# EAGLE design ME433_proto_board (EAGLE 5.12)
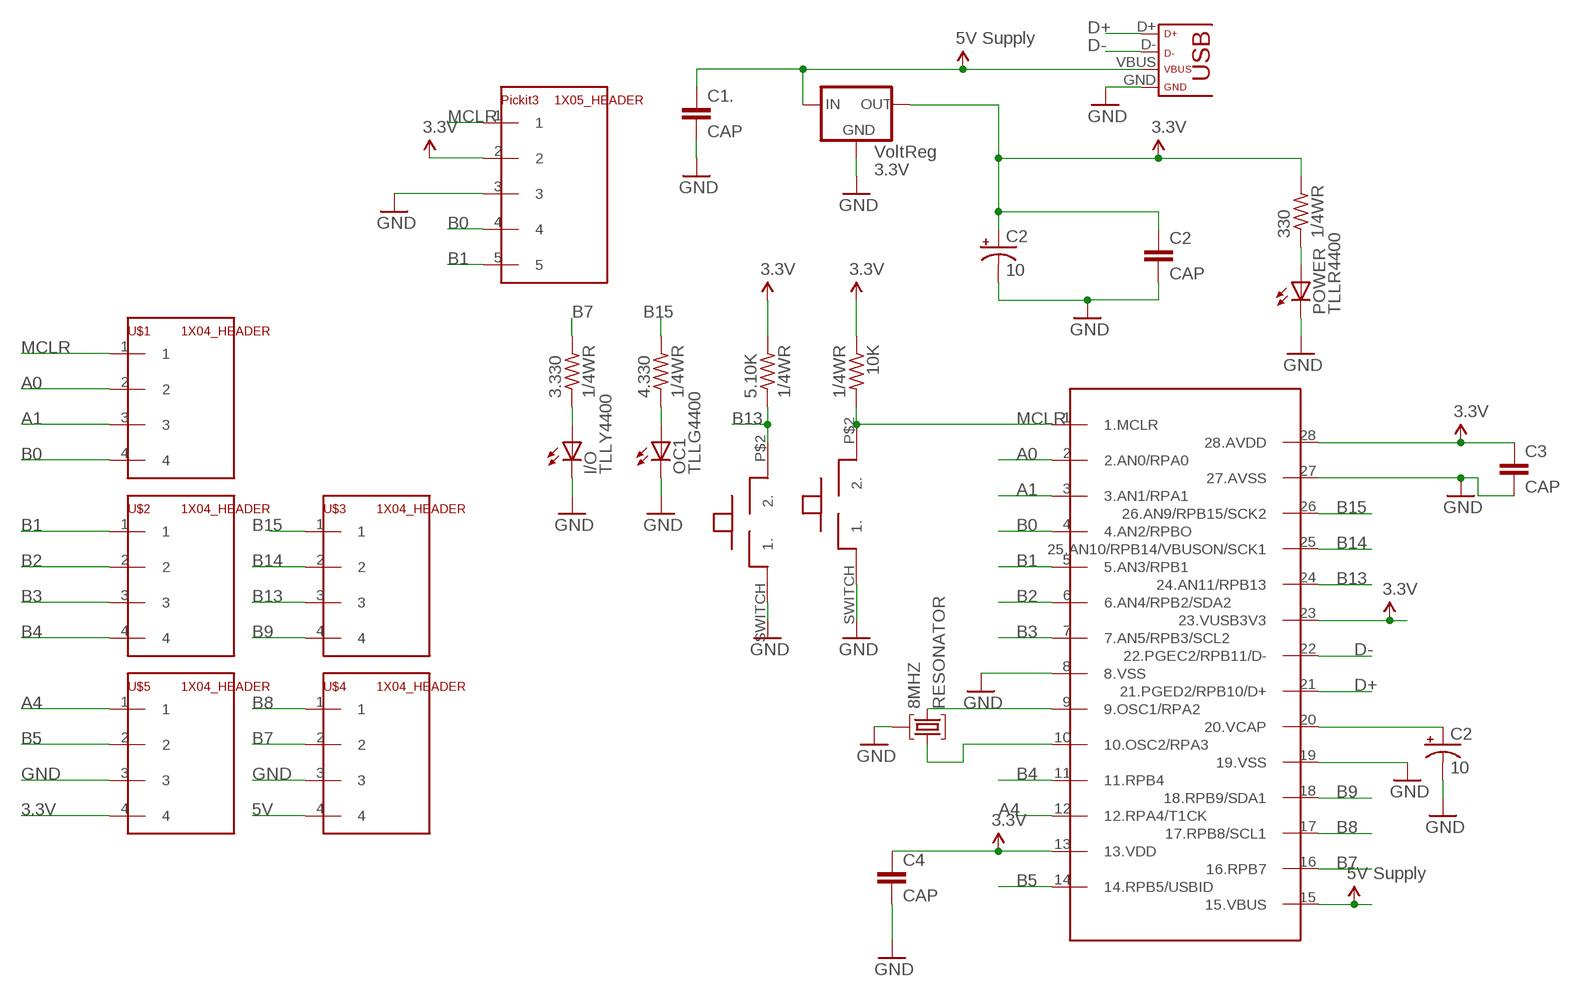
[diagram p0: schematic, sheet 1]

## Parts
3.330  1/4WR  [0207/7]
4.330  1/4WR  [0207/7]
5.10K  1/4WR  [0207/7]
8MHZ  RESONATOR  [RESONATOR]
10  CAP_POL  [CAP_POL_D]
10K  1/4WR  [0207/7]
10UF  CAP_POL  [CAP_POL_D]
330  1/4WR  [0207/7]
C1.  CAP  [C025-025X050]
C2  CAP  [C025-025X050]
C3  CAP  [C025-025X050]
C4  CAP  [C025-025X050]
I/O  TLLY4400  [LED3MM]
OC1  TLLG4400  [LED3MM]
PICKIT3  1X05_HEADER  [1X05]
POWER  TLLR4400  [LED3MM]
RESET  PUSHBUTTON  [PUSHBUTTON]
U$1  1X04_HEADER  [1X04]
U$2  1X04_HEADER  [1X04]
U$3  1X04_HEADER  [1X04]
U$4  1X04_HEADER  [1X04]
U$5  1X04_HEADER  [1X04]
U$6  USB  [USB-MINIB]
U$9  PIC32  [DIL28-3]
USER  PUSHBUTTON  [PUSHBUTTON]
VREG  LD1117  [TO220]

## Nets
3.3V: 5.10K.2 10K.1(>NAME) 10UF.1(+) 330.2 C2.1 C3.1 C4.1 PICKIT3.2 U$5.4 U$9.13(13.VDD) U$9.23(23.VUSB3V3) U$9.28(28.AVDD) VREG.2(OUT)
3.330: 3.330.1(>NAME) I/O.A
4.330: 4.330.1(>NAME) OC1.A
5V: C1..1 U$4.4 U$6.VBUS U$9.15(15.VBUS) VREG.3(IN)
A0: U$1.2 U$9.2(2.AN0/RPA0)
A1: U$1.3 U$9.3(3.AN1/RPA1)
A4: U$5.1 U$9.12(12.RPA4/T1CK)
B0: PICKIT3.4 U$1.4 U$9.4(4.AN2/RPBO)
B1: PICKIT3.5 U$2.1 U$9.5(5.AN3/RPB1)
B2: U$2.2 U$9.6(6.AN4/RPB2/SDA2)
B3: U$2.3 U$9.7(7.AN5/RPB3/SCL2)
B4: U$2.4 U$9.11(11.RPB4)
B5: U$5.2 U$9.14(14.RPB5/USBID)
B7: 3.330.2 U$4.2 U$9.16(16.RPB7)
B8: U$4.1 U$9.17(17.RPB8/SCL1)
B9: U$3.4 U$9.18(18.RPB9/SDA1)
B13: 5.10K.1(>NAME) U$3.3 U$9.24(24.AN11/RPB13) USER.P$2(2.)
B14: U$3.2 U$9.25(25.AN10/RPB14/VBUSON/SCK1)
B15: 4.330.2 U$3.1 U$9.26(26.AN9/RPB15/SCK2)
D+: U$6.D+ U$9.21(21.PGED2/RPB10/D+)
D-: U$6.D- U$9.22(22.PGEC2/RPB11/D-)
GND: 8MHZ.3 10.2(-) 10UF.2(-) C1..2 C2.2 C3.2 C4.2 I/O.K(C) OC1.K(C) PICKIT3.3 POWER.K(C) RESET.SWITCH(1.) U$4.3 U$5.3 U$6.GND U$9.8(8.VSS) U$9.19(19.VSS) U$9.27(27.AVSS) USER.SWITCH(1.) VREG.1(GND)
MCLR: 10K.2 PICKIT3.1 RESET.P$2(2.) U$1.1 U$9.1(1.MCLR)
N$1: 330.1(>NAME) POWER.A
N$4: 10.1(+) U$9.20(20.VCAP)
N$5: 8MHZ.2 U$9.9(9.OSC1/RPA2)
N$6: 8MHZ.1 U$9.10(10.OSC2/RPA3)

## Library data of the parts
3.330 4.330 5.10K 10K 330 = ME433_KT:1/4WR
8MHZ = ME433_KT:RESONATOR
10 10UF = ME433_KT:CAP_POL
C1. C2-C4 = ME433_KT:CAP
I/O = ME433_KT:TLLY4400: Low Current (2mA) LED 3 mm Tinted Diffused Package color YELLOW Source: Data sheet <http://www.farnell.com/datasheets/391098.pdf>; MF: VISHAY SEMICONDUCTOR; OC_FARNELL: 1612439
OC1 = ME433_KT:TLLG4400: Low Current (2mA) LED 3 mm Tinted Diffused Package color GREEN Source: Data sheet <http://www.farnell.com/datasheets/391098.pdf>; MF: VISHAY SEMICONDUCTOR; OC_FARNELL: 1612435
PICKIT3 = ME433_KT:1X05_HEADER
POWER = ME433_KT:TLLR4400: Low Current (2mA) LED 3 mm Tinted Diffused Package color RED Source: Data sheet <http://www.farnell.com/datasheets/391100.pdf>; MF: VISHAY SEMICONDUCTOR; OC_FARNELL: 1612437
RESET USER = ME433_KT:PUSHBUTTON
U$1-U$5 = ME433:1X04_HEADER
U$6 = ME433_KT:USB
U$9 = ME433_KT:PIC32
VREG = ME433_KT:LD1117

## Board
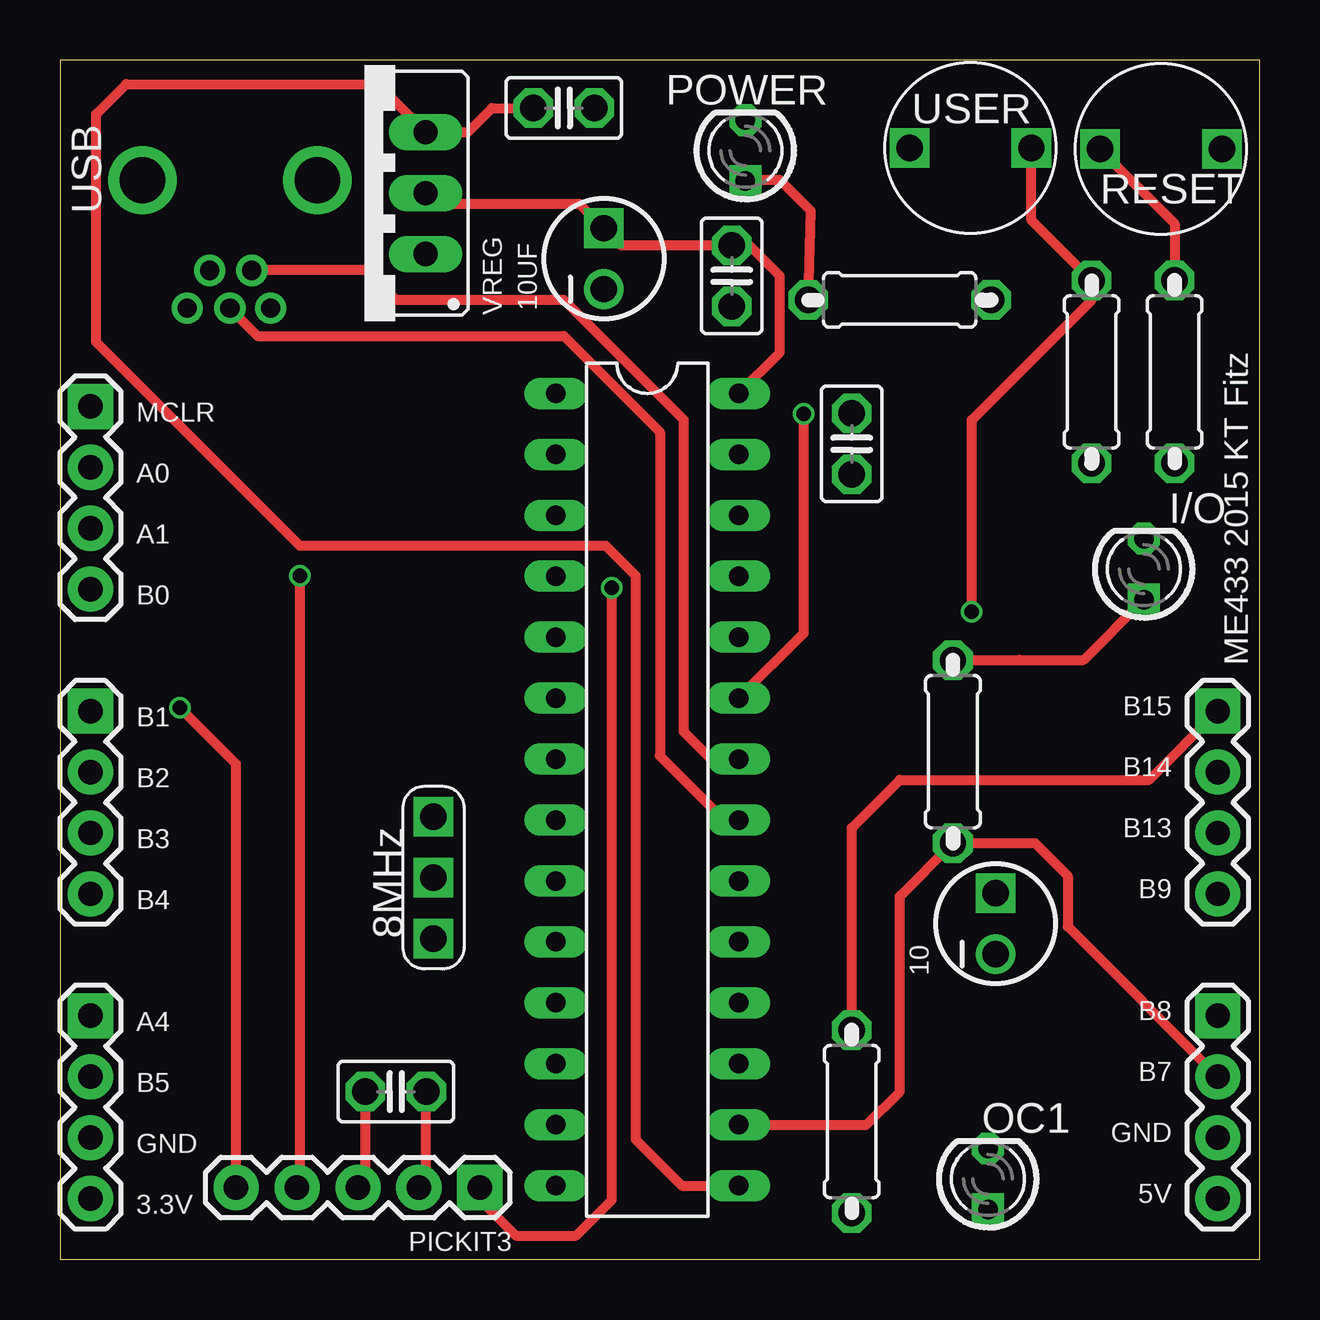
[diagram p1: board, top side]
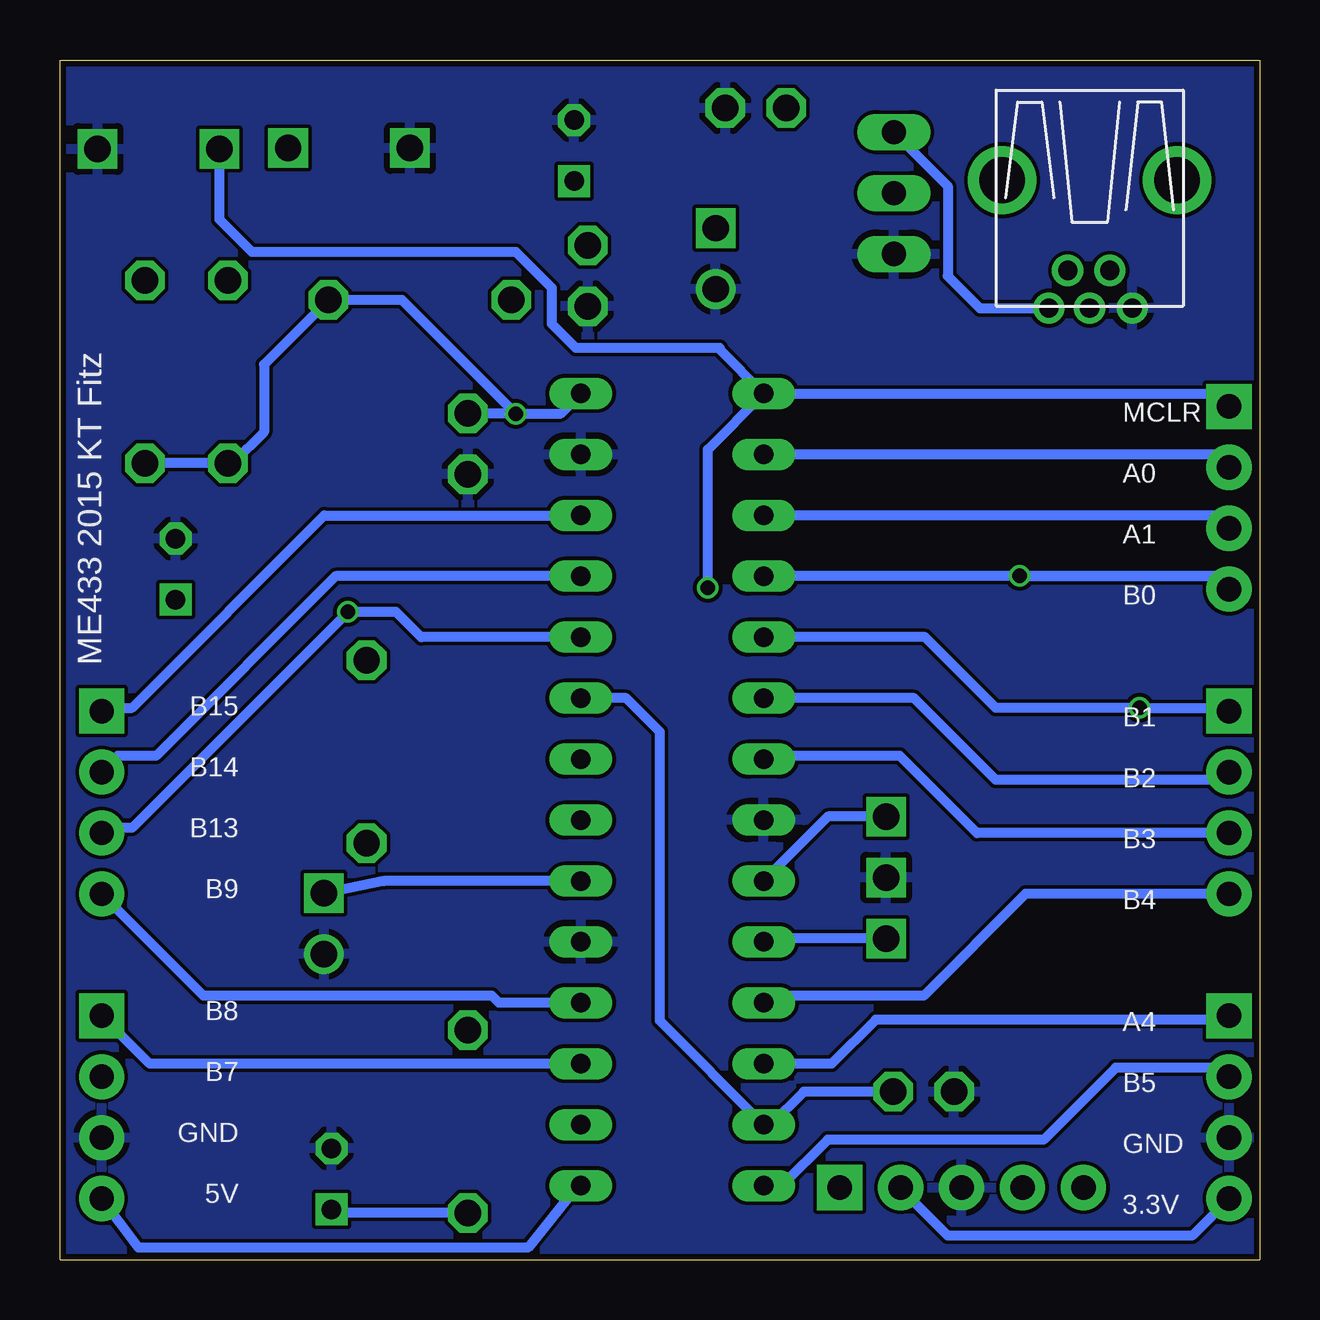
[diagram p2: board, bottom side, seen from below]

Size 50 x 50 mm. Coordinates in mm from the lower left corner, seen from the top.
Outline: 50,0 50,50 0,50 0,0 50,0
Copper layers (1*16): Top 0.035mm / dielectric 1.5mm / Bottom 0.035mm
Design rules "SeeedStudio_2layer_DRU_no_angle_20140221": minimum track width 6mil, minimum drill 12mil, track to track 6mil, track to pad 6mil, pad to pad 6mil, via to via 6mil, smd to smd 0mil, copper to edge 10mil, drill to drill 10mil, minimum pad ring 10mil, minimum via ring 6mil, stop-mask expansion 2mil, vias tented up to drill 100mil, thermal gap 10mil

### Footprints (pad centres in the part's own frame; a part is rotated, then mirrored left to right if it is on the bottom)
0207/7 = drill 1.1 octagon: 1 -3.81,0; 2 3.81,0
RESONATOR = drill 1.1 square: 1 0,-2.54; 2 0,2.54; 3 0,0
CAP_POL_D = drill 1.1 pad 1.651 square: 1 1.27,0 | drill 1.1 pad 1.651 round: 2 -1.27,0
C025-025X050 = drill 1.1 octagon: 1 -1.27,0; 2 1.27,0
LED3MM = drill 0.813 square: A -1.27,0 | drill 0.813 octagon: K 1.27,0
1X05 = drill 1.016 pad 1.88 square: 1 0,0 | drill 1.016 pad 1.88 round: 2 2.54,0; 3 5.08,0; 4 7.62,0; 5 10.16,0
PUSHBUTTON = drill 1.1 square: P$2 0,-2.54; SWITCH 0,2.54
1X04 = drill 1.016 pad 1.88 square: 1 0,0 | drill 1.016 pad 1.88 round: 2 2.54,0; 3 5.08,0; 4 7.62,0
USB-MINIB = drill 0.8 round: D+ 4.064,0; D- 2.489,0.914; GND 4.064,-1.778; ID 2.489,-0.838; VBUS 4.064,1.702 | drill 1.9 round: P$6 -1.27,-3.65; P$7 -1.27,3.65
DIL28-3 = drill 0.813 long: 1 -16.51,-3.81; 2 -13.97,-3.81; 3 -11.43,-3.81; 4 -8.89,-3.81; 5 -6.35,-3.81; 6 -3.81,-3.81; 7 -1.27,-3.81; 8 1.27,-3.81; 9 3.81,-3.81; 10 6.35,-3.81; 11 8.89,-3.81; 12 11.43,-3.81; 13 13.97,-3.81; 14 16.51,-3.81; 15 16.51,3.81; 16 13.97,3.81; 17 11.43,3.81; 18 8.89,3.81; 19 6.35,3.81; 20 3.81,3.81; 21 1.27,3.81; 22 -1.27,3.81; 23 -3.81,3.81; 24 -6.35,3.81; 25 -8.89,3.81; 26 -11.43,3.81; 27 -13.97,3.81; 28 -16.51,3.81
TO220 = drill 1.016 long: 1 -2.54,0; 2 0,0; 3 2.54,0

### Placement (x,y rotation side)
3.330  37.22,21.17 270 top
4.330  33,5.75 90 top
5.10K  43,37 270 top
8MHZ  15.57,15.92 0 top
10  39,14 90 top
10K  46.46,37 90 top
10UF  22.67,41.72 90 top
330  35,40 0 top
C1.  21,48 0 top
C2  28,41 270 top
C3  33,34 270 top
C4  14,7 180 top
I/O  45.18,28.78 90 top
OC1  38.68,3.36 90 top
PICKIT3  17.5,3 180 top
POWER  28.57,46.22 90 top
RESET  45.89,46.29 270 top
U$1  1.27,35.56 270 top
U$2  1.27,22.86 270 top
U$3  48.26,22.86 270 top
U$4  48.26,10.16 270 top
U$5  1.27,10.16 270 top
U$6  7.08,43.72 270 top
U$9  24.48,19.59 270 top
USER  37.95,46.33 90 top
VREG  15.24,44.45 90 top

### Tracks (layer width: path | path; a pad name or v marks a point on that pad's centre or on a via)
3.3V  (via drill 0.6)
  Top 0.406: VREG.2 15.69,44 21.66,44 10UF.1 23.39,42.27 C2.1 28.73,42.27 30,41 30,37.81 U$9.28 | C4.1 15.27,3.38 PICKIT3.2 | U$9.23 31,26.11 v31,35.25 31,35.27
  Bottom 0.406: 15.27,3.38 PICKIT3.2 14.96,2.96 13,1 2.81,1 U$5.4 | C4.1 19,7 20.38,5.62 U$9.13 25,9.95 25,22 26.4,23.4 U$9.23 | 10K.1 5.10K.2 42.81,33.19 41.5,34.5 41.5,37.31 330.2 35.75,40 v31,35.25 31,35.27 | 31,35.27 29.12,35.27 U$9.28 | 31,35.27 C3.1
3.330
  Top 0.406: 3.330.1 39.98,24.98 40,25 42.67,25 I/O.A
4.330
  Bottom 0.406: 4.330.1 38.53,1.94 OC1.A
5V
  Top 0.406: VREG.3 17,47 18,48 C1..1 | VREG.3 | U$9.15 25.92,3.08 24,5 24,28.5 22.75,29.75 10,29.75 1.5,38.25 1.5,47.75 2.75,49 13.23,49 VREG.3
  Bottom 0.406: U$9.15 28.42,3.08 30.5,0.5 46.72,0.5 U$4.4 | U$6.VBUS 11.66,39.66 13,41 13,44.75 VREG.3
A0
  Bottom 0.406: U$9.2 1.81,33.56 U$1.2
A1
  Bottom 0.406: U$9.3 1.81,31.02 U$1.3
A4
  Bottom 0.406: U$9.12 17.84,8.16 16,10 1.43,10 U$5.1
B0  (via drill 0.6)
  Top 0.406: PICKIT3.4 10,3.12 v10,28.5
  Bottom 0.406: 1.81,28.48 U$9.4 | 1.81,28.48 U$1.4 | 1.81,28.48 1.83,28.5 v10,28.5
B1  (via drill 0.6)
  Top 0.406: v5,23 7.34,20.66 PICKIT3.5
  Bottom 0.406: U$9.5 13.94,25.94 11,23 v5,23 1.41,23 U$2.1
B2
  Bottom 0.406: U$9.6 14.4,23.4 11,20 1.59,20 U$2.2
B3
  Bottom 0.406: U$2.3 11.78,17.78 15,21 20.53,21 U$9.7
B4
  Bottom 0.406: U$9.11 20.37,11 14,11 9.76,15.24 U$2.4
B5
  Bottom 0.406: U$9.14 19.92,3.08 18,5 9,5 6,8 1.65,8 U$5.2
B7
  Top 0.406: U$4.2 42,13.88 42,16 40.64,17.36 3.330.2 35,15.14 35,7 33.62,5.62 U$9.16
B8
  Bottom 0.406: U$9.17 46.26,8.16 U$4.1
B9
  Bottom 0.406: U$9.18 31.7,10.7 32,11 44.02,11 U$3.4
B13  (via drill 0.6)
  Top 0.406: USER.P$2 40.49,43.32 5.10K.1 43,40 38,35 v38,27
  Bottom 0.406: U$9.24 34.94,25.94 36,27 v38,27 47,18 48.04,18 U$3.3
B14
  Bottom 0.406: U$9.25 38.52,28.48 46,21 47.58,21 U$3.2
B15
  Top 0.406: U$3.1 45.4,20 35,20 33,18 4.330.2
  Bottom 0.406: U$9.26 38.98,31.02 47,23 48.12,23 U$3.1
D+
  Top 0.406: U$9.21 27.68,18.32 25,21 25,34.5 21,38.5 8.24,38.5 U$6.D+
D-
  Top 0.406: U$9.22 27.14,20.86 26,22 26,35 21,40 14,40 12.77,41.23 U$6.D-
GND
  Top 0.406: C4.2 12.73,3.31 PICKIT3.3
  pour Bottom (isolate 0.012): 0,50 50,50 50,0 0,0
MCLR  (via drill 0.6)
  Top 0.406: 10K.2 46.46,43.18 RESET.P$2 | PICKIT3.1 17.5,2.5 19,1 21.5,1 23,2.5 v23,28
  Bottom 0.406: U$9.1 1.81,36.1 U$1.1 | RESET.P$2 43.35,43.35 42,42 31,42 29.5,40.5 29.5,39 28.5,38 22.57,38 22.5,37.93 | 22.5,37.93 22.5,38 | U$9.1 22.5,37.93 | v23,28 23,33.77 U$9.1
N$1
  Top 0.406: POWER.A 28.62,45 30,45 31.3,43.7 330.1
N$4
  Bottom 0.406: U$9.20 36.49,15.78 10.1
N$5
  Bottom 0.406: U$9.9 17.99,18.46 8MHZ.2
N$6
  Bottom 0.406: U$9.10 20.53,13.38 8MHZ.1

### Text on the board
tPlace: B0
bPlace: MCLR | A0 | A1 | B0 | ME433 2015 KT Fitz | B15 | B1 | B14 | B2 | B13 | B3 | B9 | B4 | B8 | A4 | B7 | B5 | GND | GND | 5V | 3.3V
tNames: MCLR | A0 | A1 | ME433 2015 KT Fitz | B15 | B1 | B14 | B2 | B13 | B3 | B9 | B4 | B8 | A4 | B7 | B5 | GND | GND | 5V | 3.3V